# EAGLE schematic GPS (EAGLE 9.6.2)
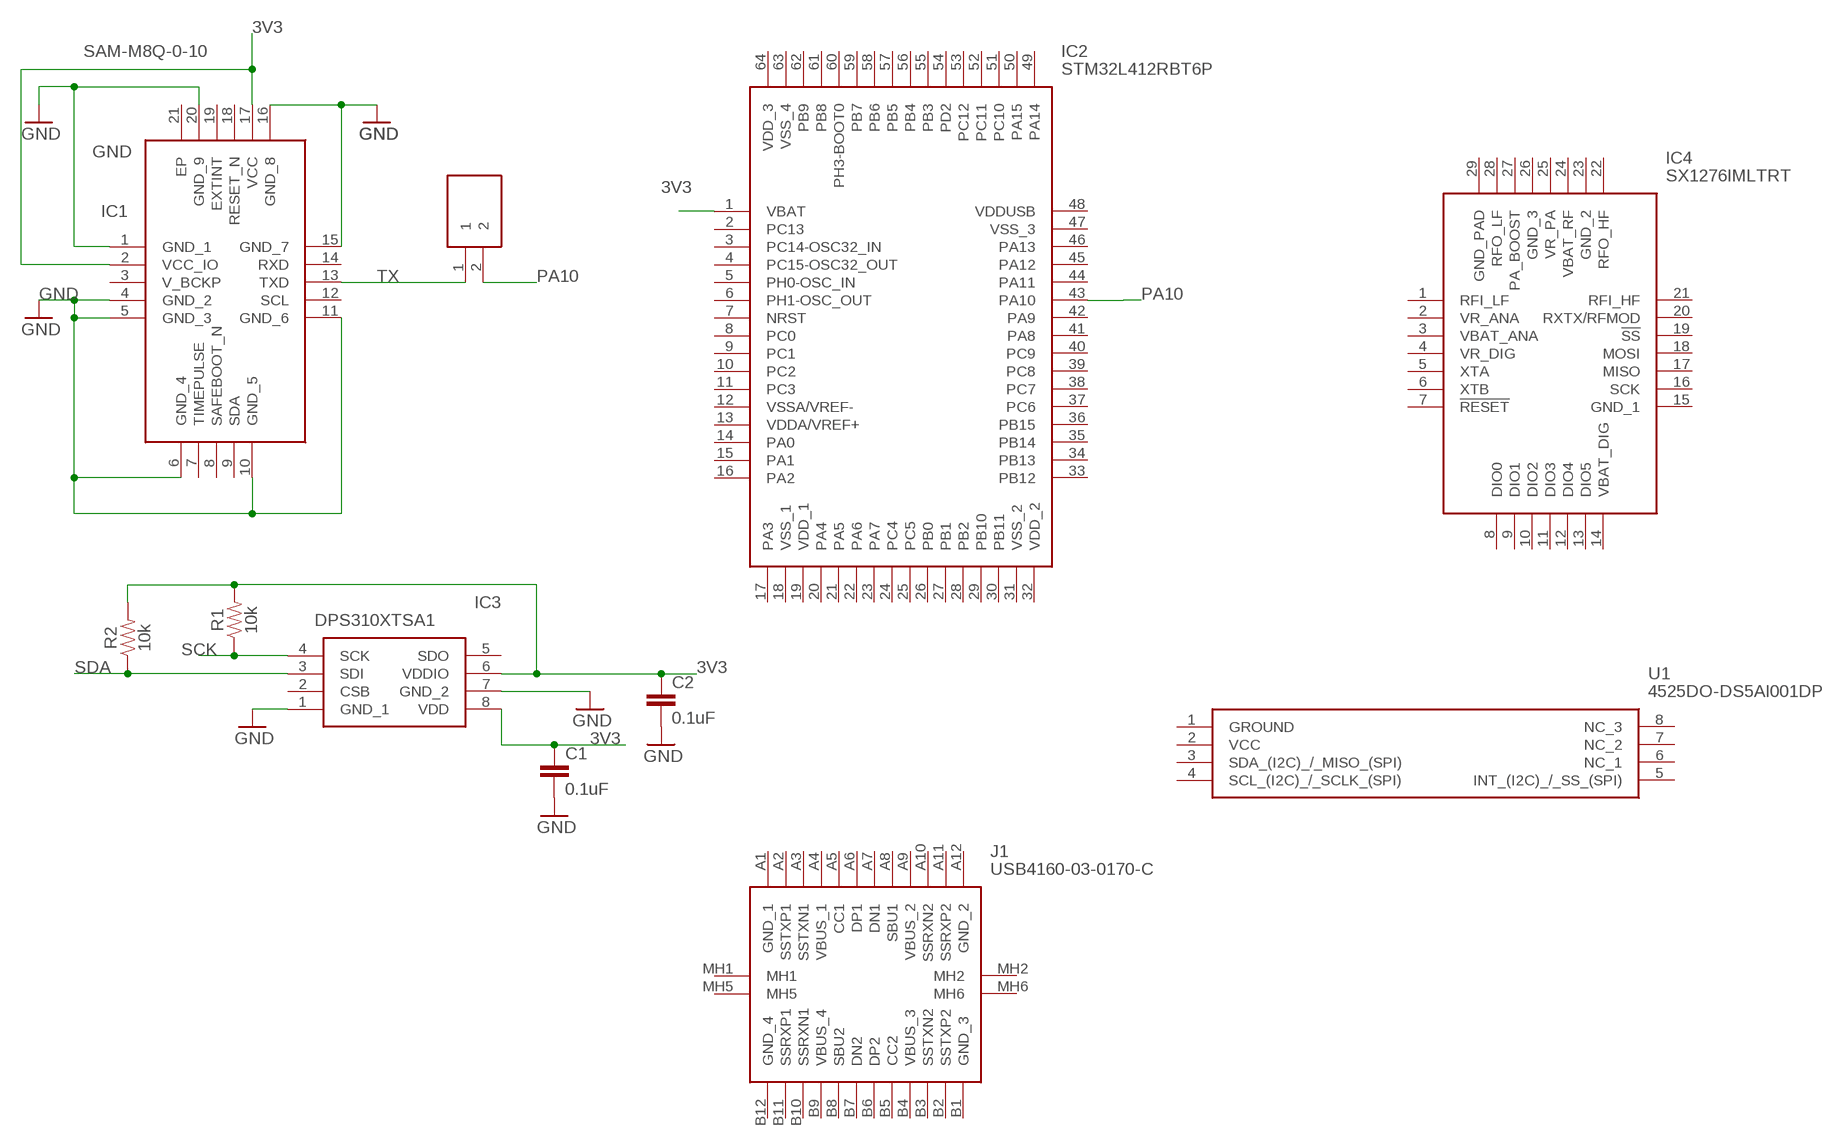
[diagram p0: schematic, sheet 1]

## Parts
C1  0.1uF  0.1UF-0402-6.3V-10%-X7R  [0402]
C2  0.1uF  0.1UF-0402-6.3V-10%-X7R  [0402]
FB1  BLM15HD102SN1  [NFZ15SG152SN10B]
IC1  SAM-M8Q-0-10  [SAMM8Q010]
IC2  STM32L412RBT6P  [QFP50P1200X1200X160-64N]
IC3  DPS310XTSA1  [DPS310XTSA1]
IC4  SX1276IMLTRT  [QFN65P600X600X100-29N]
J1  USB4160-03-0170-C  [USB4160030170C]
R1  10k  10KOHM-0402-1/16W-1%  [0402]
R2  10k  10KOHM-0402-1/16W-1%  [0402]
U1  4525DO-DS5AI001DP  [4525DO-DS...P]

## Nets
3V3: C1.1 C2.1 IC1.2(VCC_IO) IC1.17(VCC) IC2.1(VBAT) IC3.6(VDDIO) IC3.8(VDD) R1.2 R2.2
GND: C1.2 C2.2 IC1.1(GND_1) IC1.4(GND_2) IC1.5(GND_3) IC1.6(GND_4) IC1.10(GND_5) IC1.11(GND_6) IC1.15(GND_7) IC1.16(GND_8) IC1.20(GND_9) IC3.1(GND_1) IC3.7(GND_2)
PA10: FB1.2 IC2.43(PA10)
SCK: IC3.4(SCK) R1.1
SDA: IC3.3(SDI) R2.1
TX: FB1.1 IC1.13(TXD)
Unconnected: IC1.3(V_BCKP) IC1.7(TIMEPULSE) IC1.8(SAFEBOOT_N) IC1.9(SDA) IC1.12(SCL) IC1.14(RXD) IC1.18(RESET_N) IC1.19(EXTINT) IC1.21(EP) IC2.2(PC13) IC2.3(PC14-OSC32_IN) IC2.4(PC15-OSC32_OUT) IC2.5(PH0-OSC_IN) IC2.6(PH1-OSC_OUT) IC2.7(NRST) IC2.8(PC0) IC2.9(PC1) IC2.10(PC2) IC2.11(PC3) IC2.12(VSSA/VREF-) IC2.13(VDDA/VREF+) IC2.14(PA0) IC2.15(PA1) IC2.16(PA2) IC2.17(PA3) IC2.18(VSS_1) IC2.19(VDD_1) IC2.20(PA4) IC2.21(PA5) IC2.22(PA6) IC2.23(PA7) IC2.24(PC4) IC2.25(PC5) IC2.26(PB0) IC2.27(PB1) IC2.28(PB2) IC2.29(PB10) IC2.30(PB11) IC2.31(VSS_2) IC2.32(VDD_2) IC2.33(PB12) IC2.34(PB13) IC2.35(PB14) IC2.36(PB15) IC2.37(PC6) IC2.38(PC7) IC2.39(PC8) IC2.40(PC9) IC2.41(PA8) IC2.42(PA9) IC2.44(PA11) IC2.45(PA12) IC2.46(PA13) IC2.47(VSS_3) IC2.48(VDDUSB) IC2.49(PA14) IC2.50(PA15) IC2.51(PC10) IC2.52(PC11) IC2.53(PC12) IC2.54(PD2) IC2.55(PB3) IC2.56(PB4) IC2.57(PB5) IC2.58(PB6) IC2.59(PB7) IC2.60(PH3-BOOT0) IC2.61(PB8) IC2.62(PB9) IC2.63(VSS_4) IC2.64(VDD_3) IC3.2(CSB) IC3.5(SDO) IC4.1(RFI_LF) IC4.2(VR_ANA) IC4.3(VBAT_ANA) IC4.4(VR_DIG) IC4.5(XTA) IC4.6(XTB) IC4.7(!RESET) IC4.8(DIO0) IC4.9(DIO1) IC4.10(DIO2) IC4.11(DIO3) IC4.12(DIO4) IC4.13(DIO5) IC4.14(VBAT_DIG) IC4.15(GND_1) IC4.16(SCK) IC4.17(MISO) IC4.18(MOSI) IC4.19(!SS) IC4.20(RXTX/RFMOD) IC4.21(RFI_HF) IC4.22(RFO_HF) IC4.23(GND_2) IC4.24(VBAT_RF) IC4.25(VR_PA) IC4.26(GND_3) IC4.27(PA_BOOST) IC4.28(RFO_LF) IC4.29(GND_PAD) J1.A1(GND_1) J1.A2(SSTXP1) J1.A3(SSTXN1) J1.A4(VBUS_1) J1.A5(CC1) J1.A6(DP1) J1.A7(DN1) J1.A8(SBU1) J1.A9(VBUS_2) J1.A10(SSRXN2) J1.A11(SSRXP2) J1.A12(GND_2) J1.B1(GND_3) J1.B2(SSTXP2) J1.B3(SSTXN2) J1.B4(VBUS_3) J1.B5(CC2) J1.B6(DP2) J1.B7(DN2) J1.B8(SBU2) J1.B9(VBUS_4) J1.B10(SSRXN1) J1.B11(SSRXP1) J1.B12(GND_4) J1.MH1 J1.MH2 J1.MH5 J1.MH6 U1.3(SDA_(I2C)_/_MISO_(SPI)) U1.4(SCL_(I2C)_/_SCLK_(SPI)) U1.5(INT_(I2C)_/_SS_(SPI)) U1.6(NC_1) U1.7(NC_2) U1.8(NC_3)

## Power pins joined to a net without a drawn wire
GROUND: U1.1(GROUND)
VCC: U1.2(VCC)

## Library data of the parts
C1 C2 = SparkFun-Capacitors:0.1UF: 0.1µF ceramic capacitors A capacitor is a passive two-terminal electrical component used to store electrical energy temporarily in an electric field.; PROD_ID: CAP-14993
FB1 = BLM15HD102SN1:BLM15HD102SN1: Ferrite Beads Source: Datasheet <http://www.murata.com/~/media/webrenewal/support/library/catalog/products/emc/emifil/c31e.ashx?la=en-gb>; DESCRIPTION: Ferrite Beads; HEIGHT: 0.55mm; MANUFACTURER_NAME: Murata Electronics; MANUFACTURER_PART_NUMBER: BLM15HD102SN1; MOUSER_PART_NUMBER: N/A; MOUSER_PRICE-STOCK: https://www.mouser.co.uk/ProductDetail/Murata-Electronics/BLM15HD102SN1?qs=%2F7R%2FnUXKGoiRMnYJExxoAg%3D%3D
IC1 = SAM-M8Q-0-10:SAM-M8Q-0-10: GNSS antenna module Source: Datasheet <https://www.u-blox.com/sites/default/files/SAM-M8Q_DataSheet_(UBX-16012619).pdf>; DESCRIPTION: GNSS antenna module; HEIGHT: 3mm; MANUFACTURER_NAME: U-Blox; MANUFACTURER_PART_NUMBER: SAM-M8Q-0-10; MOUSER_PART_NUMBER: N/A; MOUSER_PRICE-STOCK: https://www.mouser.co.uk/ProductDetail/u-blox/SAM-M8Q-0-10?qs=KUoIvG%2F9IlYKGQbFkOKljQ%3D%3D
IC2 = STM32L412RBT6P:STM32L412RBT6P: ARM Microcontrollers - MCU Source: Datasheet <https://www.st.com/resource/en/datasheet/stm32l412c8.pdf>; DESCRIPTION: ARM Microcontrollers - MCU; HEIGHT: 1.6mm; MANUFACTURER_NAME: STMicroelectronics; MANUFACTURER_PART_NUMBER: STM32L412RBT6P; MOUSER_PART_NUMBER: 511-STM32L412RBT6P; MOUSER_PRICE-STOCK: https://www.mouser.co.uk/ProductDetail/STMicroelectronics/STM32L412RBT6P?qs=l7cgNqFNU1hh%252BU1wOZs5Xg%3D%3D
IC3 = DPS310XTSA1:DPS310XTSA1: INFINEON - DPS310XTSA1 - DIGITAL PRESSURE SENSOR, 1200HPA, VLGA-8 Source: Datasheet <https://www.infineon.com/dgdl/Infineon-DPS310-DS-v01_00-EN.pdf?fileId=5546d462576f34750157750826c42242>; ARROW_PART_NUMBER: DPS310XTSA1; ARROW_PRICE-STOCK: https://www.arrow.com/en/products/dps310xtsa1/infineon-technologies-ag?region=nac; DESCRIPTION: INFINEON - DPS310XTSA1 - DIGITAL PRESSURE SENSOR, 1200HPA, VLGA-8; HEIGHT: 1.01mm; MANUFACTURER_NAME: Infineon; MANUFACTURER_PART_NUMBER: DPS310XTSA1; MOUSER_PART_NUMBER: 726-DPS310XTSA1; MOUSER_PRICE-STOCK: https://www.mouser.co.uk/ProductDetail/Infineon-Technologies/DPS310XTSA1?qs=uuTTuBTXn66Ynca8WHwycg%3D%3D
IC4 = SX1276IMLTRT:SX1276IMLTRT: RF Transceiver SINGLE CHIP 3 BANDS TRANCEIVER Source: Datasheet <https://componentsearchengine.com/Datasheets/1/SX1276IMLTRT.pdf>; ARROW_PART_NUMBER: SX1276IMLTRT; ARROW_PRICE-STOCK: https://www.arrow.com/en/products/sx1276imltrt/semtech?region=europe; DESCRIPTION: RF Transceiver SINGLE CHIP 3 BANDS TRANCEIVER; HEIGHT: 1mm; MANUFACTURER_NAME: SEMTECH; MANUFACTURER_PART_NUMBER: SX1276IMLTRT; MOUSER_PART_NUMBER: 947-SX1276IMLTRT; MOUSER_PRICE-STOCK: https://www.mouser.co.uk/ProductDetail/Semtech/SX1276IMLTRT?qs=rBWM4%252BvDhIceYQoeMKd%2FQQ%3D%3D
J1 = USB4160-03-0170-C:USB4160-03-0170-C: USB Connectors USB-C Rec 3u" Vert 24P SMT 1.7mm TH stakes H7.46mm T+R+Cap Source: Datasheet <https://gct.co/Files/Drawings/USB4160.pdf?v=75f6cea7-84cd-41d4-89e8-137dc7b10777>; DESCRIPTION: USB Connectors USB-C Rec 3u" Vert 24P SMT 1.7mm TH stakes H7.46mm T+R+Cap; HEIGHT: 7.66mm; MANUFACTURER_NAME: GCT (GLOBAL CONNECTOR TECHNOLOGY); MANUFACTURER_PART_NUMBER: USB4160-03-0170-C; MOUSER_PART_NUMBER: 640-USB4160-3-0170-C; MOUSER_PRICE-STOCK: https://www.mouser.co.uk/ProductDetail/GCT/USB4160-03-0170-C?qs=vvQtp7zwQdMCGQNngnxScA%3D%3D
R1 R2 = SparkFun-Resistors:10KOHM: 10kΩ resistor A resistor is a passive two-terminal electrical component that implements electrical resistance as a circuit element. Resistors act to reduce current flow, and, at the same time, act to lower voltage levels within circuits. - Wikipedia; PROD_ID: RES-14241
U1 = 4525DO-DS5AI001DP:4525DO-DS5AI001DP: Differential Pressure Sensor 1PSI Dual Barbs Source: Datasheet <http://www.te.com/commerce/DocumentDelivery/DDEController?Action=srchrtrv&DocNm=MS4525DO&DocType=DS&DocLang=English>; ARROW_PART_NUMBER: 4525DO-DS5AI001DP; ARROW_PRICE-STOCK: https://www.arrow.com/en/products/4525do-ds5ai001dp/te-connectivity; DESCRIPTION: Differential Pressure Sensor 1PSI Dual Barbs; HEIGHT: mm; MANUFACTURER_NAME: TE Connectivity; MANUFACTURER_PART_NUMBER: 4525DO-DS5AI001DP; MOUSER_PART_NUMBER: 824-4525DODS5AI001DP; MOUSER_PRICE-STOCK: https://www.mouser.co.uk/ProductDetail/Measurement-Specialties/4525DO-DS5AI001DP?qs=oFx6pF86PmDUpUCTX7loEA%3D%3D